# Altium schematic sheet BSPD23.SchDoc
size A4; SheetNumber: 1; SheetTotal: 1
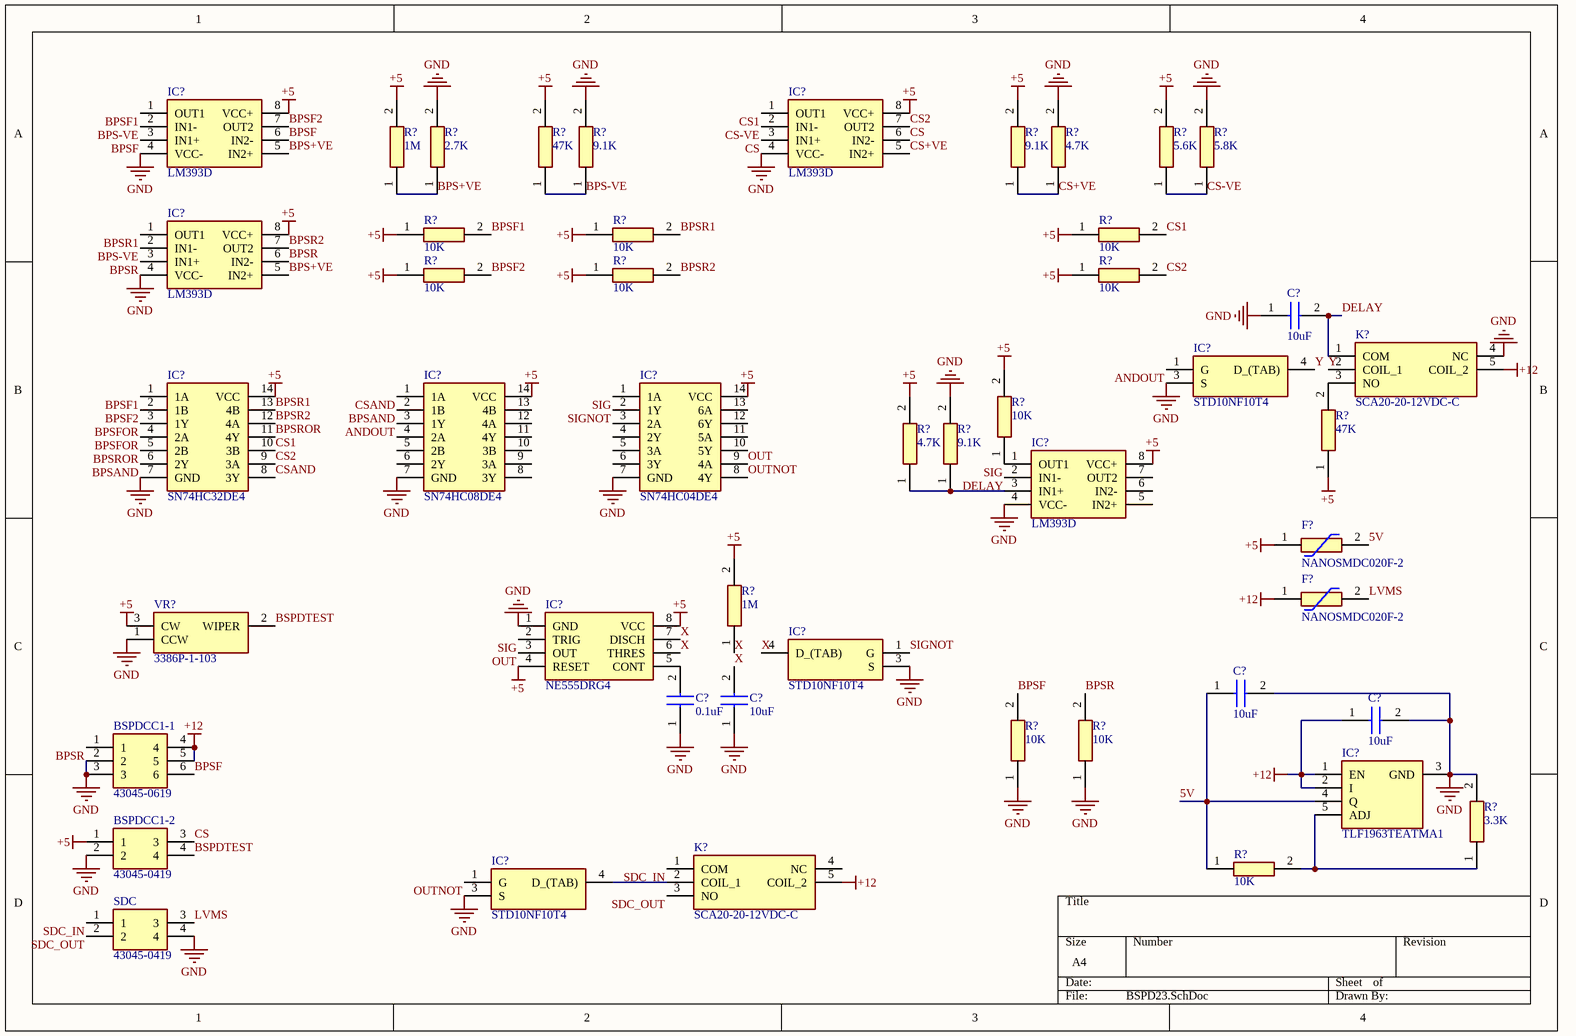
[diagram p0: BSPD23.SchDoc]

## Parts
(Parts that share a designator on the sheet are numbered #1, #2 ... from top to bottom, then left to right.)
BSPDCC1-1  43045-0619  [43045-06YY_181920]
BSPDCC1-2  43045-0419  [43045-04YY_181920]
C?#1  10uF  [CAPC3225X145N]
C?#2  10uF  [CAPC3225X145N]
C?#3  10uF  [CAPC3225X145N]
C?#4  0.1uF  [CAPC3225X145N]
C?#5  10uF  [CAPC3225X145N]
F?#1  NANOSMDC020F-2  [NANOSMDC016F2]
F?#2  NANOSMDC020F-2  [NANOSMDC016F2]
IC?#1  LM393D  [SOIC127P600X175-8N]
IC?#2  LM393D  [SOIC127P600X175-8N]
IC?#3  LM393D  [SOIC127P600X175-8N]
IC?#4  STD10NF10T4  [TO228P972X240-3N]
IC?#5  SN74HC32DE4  [SOIC127P600X175-14N]
IC?#6  SN74HC08DE4  [SOIC127P600X175-14N]
IC?#7  SN74HC04DE4  [SOIC127P600X175-14N]
IC?#8  LM393D  [SOIC127P600X175-8N]
IC?#9  NE555DRG4  [SOIC127P600X175-8N]
IC?#10  STD10NF10T4  [TO228P972X240-3N]
IC?#11  TLF1963TEATMA1  [TLF1963TEATMA1]
IC?#12  STD10NF10T4  [TO228P972X240-3N]
K?#1  SCA20-20-12VDC-C  [SCA202012VDCC]
K?#2  SCA20-20-12VDC-C  [SCA202012VDCC]
R?#1  1M  [RESC3126X60N]
R?#2  2.7K  [RESC3126X60N]
R?#3  47K  [RESC3126X60N]
R?#4  9.1K  [RESC3126X60N]
R?#5  9.1K  [RESC3126X60N]
R?#6  4.7K  [RESC3126X60N]
R?#7  5.6K  [RESC3126X60N]
R?#8  5.8K  [RESC3126X60N]
R?#9  10K  [RESC3126X60N]
R?#10  10K  [RESC3126X60N]
R?#11  10K  [RESC3126X60N]
R?#12  10K  [RESC3126X60N]
R?#13  10K  [RESC3126X60N]
R?#14  10K  [RESC3126X60N]
R?#15  10K  [RESC3126X60N]
R?#16  47K  [RESC3126X60N]
R?#17  4.7K  [RESC3126X60N]
R?#18  9.1K  [RESC3126X60N]
R?#19  1M  [RESC3126X60N]
R?#20  10K  [RESC3126X60N]
R?#21  10K  [RESC3126X60N]
R?#22  10K  [RESC3126X60N]
R?#23  3.3K  [RESC3126X60N]
SDC  43045-0419  [43045-04YY_181920]
VR?  3386P-1-103  [3386P1103TLF]

## Nets
+5: BSPDCC1-2.1 F?#1.1 IC?#1.8(VCC+) IC?#2.8(VCC+) IC?#3.8(VCC+) IC?#5.14(VCC) IC?#6.14(VCC) IC?#7.14(VCC) IC?#8.8(VCC+) IC?#9.4(RESET) IC?#9.8(VCC) R?#1.2 R?#3.2 R?#5.2 R?#7.2 R?#9.1 R?#10.1 R?#11.1 R?#12.1 R?#13.1 R?#14.1 R?#15.2 R?#16.1 R?#17.2 R?#19.2 VR?.3(CW)
+12: BSPDCC1-1.4 BSPDCC1-1.5 C?#3.1 F?#2.1 IC?#11.1(EN) IC?#11.2(I) K?#1.5(COIL_2) K?#2.5(COIL_2)
GND: BSPDCC1-1.2 BSPDCC1-1.3 BSPDCC1-2.2 C?#1.1 C?#2.2 C?#3.2 C?#4.1 C?#5.1 IC?#1.4(VCC-) IC?#2.4(VCC-) IC?#3.4(VCC-) IC?#4.3(S) IC?#5.7(GND) IC?#6.7(GND) IC?#7.7(GND) IC?#8.4(VCC-) IC?#9.1(GND) IC?#10.3(S) IC?#11.3(GND) IC?#12.3(S) K?#1.4(NC) R?#2.2 R?#4.2 R?#6.2 R?#8.2 R?#18.2 R?#20.1 R?#21.1 R?#23.2 SDC.4 VR?.1(CCW)
5V: C?#2.1 F?#1.2 IC?#11.4(Q) R?#22.1
ANDOUT: IC?#4.1(G) IC?#6.3(1Y)
BPS+VE: IC?#1.5(IN2+) IC?#3.5(IN2+) R?#1.1 R?#2.1
BPS-VE: IC?#1.2(IN1-) IC?#3.2(IN1-) R?#3.1 R?#4.1
BPSAND: IC?#5.6(2Y) IC?#6.2(1B)
BPSF: BSPDCC1-1.6 IC?#1.3(IN1+) IC?#1.6(IN2-) R?#20.2
BPSF1: IC?#1.1(OUT1) IC?#5.1(1A) R?#9.2
BPSF2: IC?#1.7(OUT2) IC?#5.2(1B) R?#12.2
BPSFOR: IC?#5.3(1Y) IC?#5.4(2A)
BPSR: BSPDCC1-1.1 IC?#3.3(IN1+) IC?#3.6(IN2-) R?#21.2
BPSR1: IC?#3.1(OUT1) IC?#5.13(4B) R?#10.2
BPSR2: IC?#3.7(OUT2) IC?#5.12(4A) R?#13.2
BPSROR: IC?#5.5(2B) IC?#5.11(4Y)
BSPDTEST: BSPDCC1-2.4 VR?.2(WIPER)
CS: BSPDCC1-2.3 IC?#2.3(IN1+) IC?#2.6(IN2-)
CS1: IC?#2.1(OUT1) IC?#5.10(3B) R?#11.2
CS2: IC?#2.7(OUT2) IC?#5.9(3A) R?#14.2
CS+VE: IC?#2.5(IN2+) R?#5.1 R?#6.1
CS-VE: IC?#2.2(IN1-) R?#7.1 R?#8.1
CSAND: IC?#5.8(3Y) IC?#6.1(1A)
DELAY: C?#1.2 IC?#8.2(IN1-) K?#1.1(COM)
LVMS: F?#2.2 SDC.3
OUT: IC?#7.9(4A) IC?#9.3(OUT)
OUTNOT: IC?#7.8(4Y) IC?#12.1(G)
SDC_IN: K?#2.1(COM) SDC.1
SDC_OUT: K?#2.3(NO) SDC.2
SIG: IC?#7.1(1A) IC?#8.1(OUT1) IC?#9.2(TRIG) R?#15.1
SIGNOT: IC?#7.2(1Y) IC?#10.1(G)
X: C?#5.2 IC?#9.6(THRES) IC?#9.7(DISCH) IC?#10.4(D_(TAB)) R?#19.1
Y: IC?#4.4(D_(TAB)) K?#1.2(COIL_1)
NetC?#4_2: C?#4.2 IC?#9.5(CONT)
NetIC?#8_3: IC?#8.3(IN1+) R?#17.1 R?#18.1
NetIC?#11_5: IC?#11.5(ADJ) R?#22.2 R?#23.1
NetIC?#12_4: IC?#12.4(D_(TAB)) K?#2.2(COIL_1)
NetK?#1_3: K?#1.3(NO) R?#16.2

Not connected (* = marked no-connect by the designer): IC?#6 4(2A) 5(2B) 6(2Y) 8(3Y) 9(3A) 10(3B) 11(4Y) 12(4A) 13(4B); IC?#7 3(2A) 4(2Y) 5(3A) 6(3Y) 10(5Y) 11(5A) 12(6Y) 13(6A); IC?#8 5(IN2+) 6(IN2-) 7(OUT2); K?#2 4(NC)

## Library data of the parts
BSPDCC1-1 = 43045-0619: Connector; Manufacturer_Name: Molex; Datasheet Link: https://www.molex.com/pdm_docs/sd/430450218_sd.pdf; Height: 9.91mm; Manufacturer_Part_Number: 43045-0619; Mouser Part Number: 538-43045-0619; Mouser Price/Stock: https://www.mouser.co.uk/ProductDetail/Molex/43045-0619?qs=KC2ywxza1kr7EVu5MuTw7g%3D%3D; Arrow Part Number: 43045-0619; Arrow Price/Stock: https://www.arrow.com/en/products/43045-0619/molex
BSPDCC1-2 SDC = 43045-0419: Connector; Manufacturer_Name: Molex; Datasheet Link: https://www.molex.com/pdm_docs/sd/430450218_sd.pdf; Height: 9.91mm; Manufacturer_Part_Number: 43045-0419; Mouser Part Number: 538-43045-0419; Mouser Price/Stock: https://www.mouser.co.uk/ProductDetail/Molex/43045-0419?qs=UeCeOHRHQebVNIQyI9VWWg%3D%3D
C?#1-C?#5 = CC1210KKX7R8BB105: Capacitor; Manufacturer_Name: YAGEO (PHYCOMP); Datasheet Link: https://datasheet.datasheetarchive.com/originals/distributors/Datasheets_SAMA/d9f127a4875522309d99aa7dec79633c.pdf; Height: 1.45mm; Manufacturer_Part_Number: CC1210KKX7R8BB105; Mouser Part Number: 603-CC121KKX7R8BB105; Mouser Price/Stock: https://www.mouser.com/Search/Refine.aspx?Keyword=603-CC121KKX7R8BB105; Arrow Part Number: CC1210KKX7R8BB105; Arrow Price/Stock: https://www.arrow.com/en/products/cc1210kkx7r8bb105/yageo?region=nac
F?#1 F?#2 = NANOSMDC020F-2: Resettable Fuse; Manufacturer_Name: LITTELFUSE; Datasheet Link: https://www.littelfuse.com/~/media/electronics/datasheets/resettable_ptcs/littelfuse_ptc_nanosmdc_datasheet.pdf.pdf; Height: 1mm; Manufacturer_Part_Number: NANOSMDC020F-2; Mouser Part Number: 650-NANOSMDC020F-2; Mouser Price/Stock: https://www.mouser.co.uk/ProductDetail/Littelfuse/NANOSMDC020F-2?qs=iK0evp%252BCRRU6agwMt7HYjg%3D%3D; Arrow Part Number: NANOSMDC020F-2; Arrow Price/Stock: https://www.arrow.com/en/products/nanosmdc020f-2/littelfuse
IC?#1-IC?#3 IC?#8 = LM393D: Integrated Circuit; Manufacturer_Name: STMicroelectronics; Datasheet Link: http://www.st.com/st-web-ui/static/active/en/resource/technical/document/datasheet/CD00000465.pdf; Height: 1.75mm; Manufacturer_Part_Number: LM393D; Mouser Part Number: 511-LM393D; Mouser Price/Stock: https://www.mouser.co.uk/ProductDetail/STMicroelectronics/LM393D?qs=htKRmzjvioSpfPyLiLnV1A%3D%3D; Arrow Part Number: LM393D; Arrow Price/Stock: https://www.arrow.com/en/products/lm393d/stmicroelectronics?region=europe
IC?#4 IC?#10 IC?#12 = STD10NF10T4: Integrated Circuit; Manufacturer_Name: STMicroelectronics; Datasheet Link: http://www.st.com/web/en/resource/technical/document/datasheet/CD00002133.pdf; Height: 2.4mm; Manufacturer_Part_Number: STD10NF10T4; Mouser Part Number: 511-STD10NF10; Mouser Price/Stock: https://www.mouser.co.uk/ProductDetail/STMicroelectronics/STD10NF10T4?qs=El1T93pd01%2FBh%252BX9NfIsIQ%3D%3D; Arrow Part Number: STD10NF10T4; Arrow Price/Stock: https://www.arrow.com/en/products/std10nf10t4/stmicroelectronics
IC?#5 = SN74HC32DE4: Integrated Circuit; Manufacturer_Name: Texas Instruments; Datasheet Link: https://www.ti.com/lit/ds/symlink/sn54hc32.pdf; Height: 1.75mm; Manufacturer_Part_Number: SN74HC32DE4; Mouser Part Number: 595-SN74HC32DE4; Mouser Price/Stock: https://www.mouser.co.uk/ProductDetail/Texas-Instruments/SN74HC32DE4?qs=AgY10sKTvDJr47%2F3FTMbxg%3D%3D; Arrow Part Number: SN74HC32DE4; Arrow Price/Stock: https://www.arrow.com/en/products/sn74hc32de4/texas-instruments
IC?#6 = SN74HC08DE4: Integrated Circuit; Manufacturer_Name: Texas Instruments; Datasheet Link: https://www.ti.com/lit/ds/symlink/sn74hc08.pdf?ts=1618731494776&ref_url=https%253A%252F%252Fwww.ti.com%252Fstore%252Fti%252Fen%252Fp%252Fproduct%252F%253Fp%253DSN74HC08D; Height: 1.75mm; Manufacturer_Part_Number: SN74HC08DE4; Mouser Part Number: 595-SN74HC08DE4; Mouser Price/Stock: https://www.mouser.co.uk/ProductDetail/Texas-Instruments/SN74HC08DE4?qs=AgY10sKTvDKhnfdcduehlw%3D%3D; Arrow Part Number: SN74HC08DE4; Arrow Price/Stock: https://www.arrow.com/en/products/sn74hc08de4/texas-instruments
IC?#7 = SN74HC04DE4: Integrated Circuit; Manufacturer_Name: Texas Instruments; Datasheet Link: http://www.ti.com/general/docs/suppproductinfo.tsp?distId=10&gotoUrl=http%3A%2F%2Fwww.ti.com%2Flit%2Fgpn%2Fsn74hc04; Height: 1.75mm; Manufacturer_Part_Number: SN74HC04DE4; Mouser Part Number: 595-SN74HC04DE4; Mouser Price/Stock: https://www.mouser.co.uk/ProductDetail/Texas-Instruments/SN74HC04DE4?qs=mE33ZKBHyE7BqpKQ08Viig%3D%3D; Arrow Part Number: SN74HC04DE4; Arrow Price/Stock: https://www.arrow.com/en/products/sn74hc04de4/texas-instruments
IC?#9 = NE555DRG4: Integrated Circuit; Manufacturer_Name: Texas Instruments; Datasheet Link: http://www.mouser.com/ds/2/405/ne555-557499.pdf; Height: 1.75mm; Manufacturer_Part_Number: NE555DRG4; Mouser Part Number: 595-NE555DRG4; Mouser Price/Stock: https://www.mouser.co.uk/ProductDetail/Texas-Instruments/NE555DRG4?qs=rLYyFdxB%2FmreBHawQCpQ0Q%3D%3D; Arrow Part Number: NE555DRG4; Arrow Price/Stock: https://www.arrow.com/en/products/ne555drg4/texas-instruments?region=nac
IC?#11 = TLF1963TEATMA1: Integrated Circuit; Manufacturer_Name: Infineon; Datasheet Link: https://www.infineon.com/dgdl/Infineon-TLF1963-DS-v01_00-EN.pdf?fileId=5546d46258fc0bc1015969d2981941e0; Height: 2.35mm; Manufacturer_Part_Number: TLF1963TEATMA1; Mouser Part Number: 726-TLF1963TEATMA1; Mouser Price/Stock: https://www.mouser.co.uk/ProductDetail/Infineon-Technologies/TLF1963TEATMA1?qs=SiyfpgnvCZluIGE%2FbZiglw%3D%3D; Arrow Part Number: TLF1963TEATMA1; Arrow Price/Stock: https://www.arrow.com/en/products/tlf1963teatma1/infineon-technologies-ag?region=nac
K?#1 K?#2 = SCA20-20-12VDC-C: Relay or Contactor; Manufacturer_Name: LEONE; Datasheet Link: https://www.kuraelectronics.com/new-pdf/SCA%2020.pdf; Height: 13.7mm; Manufacturer_Part_Number: SCA20-20-12VDC-C
R?#1-R?#23 = RC1210JR-0710KL: Resistor; Manufacturer_Name: YAGEO (PHYCOMP); Datasheet Link: http://www.yageo.com/documents/recent/PYu-RC1210_51_RoHS_L_(4).pdf; Height: 0.6mm; Manufacturer_Part_Number: RC1210JR-0710KL; Mouser Part Number: 603-RC1210JR-0710KL; Mouser Price/Stock: https://www.mouser.co.uk/ProductDetail/Yageo/RC1210JR-0710KL?qs=6sj9KdP9svgfoubno5Jb%252BA%3D%3D; Arrow Part Number: RC1210JR-0710KL; Arrow Price/Stock: https://www.arrow.com/en/products/rc1210jr-0710kl/yageo
VR? = 3386P-1-103: Variable Resistor; Manufacturer_Name: Bourns; Datasheet Link: https://www.mouser.com/datasheet/2/54/3386-776606.pdf; Height: 4.83mm; Manufacturer_Part_Number: 3386P-1-103; Mouser Part Number: 652-3386P-1-103; Mouser Price/Stock: https://www.mouser.co.uk/ProductDetail/Bourns/3386P-1-103?qs=8ovTl4njQkUNVfkrJ%252Bl%2Fgw%3D%3D; Arrow Part Number: 3386P-1-103; Arrow Price/Stock: https://www.arrow.com/en/products/3386p-1-103/bourns?region=nac